# Altium schematic sheet 13.Motor DriverB.SchDoc
size 297 x 209 mm
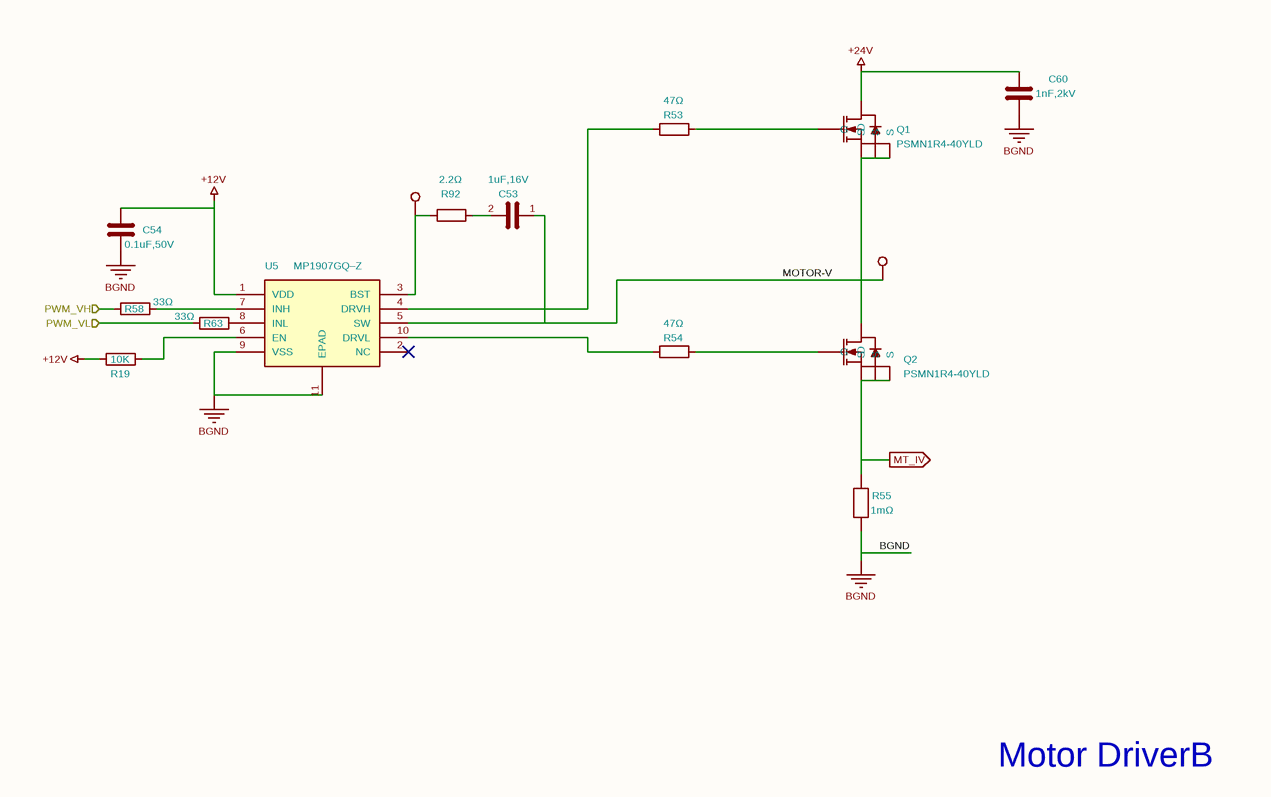
[diagram p0: 13.Motor DriverB.SchDoc]

## Parts
C53  1uF,16V  [C_0603_1608Metric]
C54  0.1uF,50V  [C_0603_1608Metric]
C60  1nF,2kV  [C_1206_3216Metric]
Q1  PSMN1R4-40YLD  [sot_669_2]
Q2  PSMN1R4-40YLD  [sot_669_2]
R19  10K  [R_0402_1005Metric]
R53  47Ω  [R_0603_1608Metric]
R54  47Ω  [R_0603_1608Metric]
R55  1mΩ  [R2010]
R58  33Ω  [R_0402_1005Metric]
R63  33Ω  [R_0402_1005Metric]
R92  2.2Ω  [R_0603_1608Metric]
TP4  0.5mm  [SMD_3mm_Pad]  (value not drawn)
TP16  0.5mm  [TestPoint_Pad_D0.5mm]  (value not drawn)
U5  MP1907GQ–Z  [QFN-10_L3.0-W3.0-P0.50-LS3.0-BL-EP]

## Ports
MT_IV (out), PWM_VH (in), PWM_VL (in)

## Nets
+12V: C54.1 R19.1 U5.1(VDD)
+24V: C60.1 Q1.5(D)
BGND: C54.2 C60.2 R55.1 U5.9(VSS) U5.11(EPAD)
MOTOR-V: C53.1 Q1.1(S) Q1.2(S) Q1.3(S) Q2.5(D) TP4.1 U5.5(SW)
MT_IV: Q2.1(S) Q2.2(S) Q2.3(S) R55.2 ; port MT_IV
PWM_VH: R58.1 ; port PWM_VH
PWM_VL: R63.1 ; port PWM_VL
NetC53_2: C53.2 R92.2
NetQ1_4: Q1.4(G) R53.2
NetQ2_4: Q2.4(G) R54.2
NetR19_2: R19.2 U5.6(EN)
NetR53_1: R53.1 U5.4(DRVH)
NetR54_1: R54.1 U5.10(DRVL)
NetR58_2: R58.2 U5.7(INH)
NetR63_2: R63.2 U5.8(INL)
NetR92_1: R92.1 TP16.1 U5.3(BST)

Not connected (* = marked no-connect by the designer): U5 2(NC)*

## Notes on the sheet
- Motor DriverB
- 1
- 2
- 3
- 4
- 5
- 6
- A
- B
- C
- D
- Title: HPM6E8Y_RbMotor_ECAT
- File: 13.Motor DriverB.kicad_sch
- Sheet: /
- KiCad E.D.A.  kicad (5.1.4)-1
- Size: A4
- Date:
- Rev: RevB+
- Id: 1/1

## Library data of the parts
C53 = 1uF,16V_0603: Model: CL10A105KO8NNNC; Company: SAMSUNG(三星); Value: 1uF,16V; Footprint: 03_HPM_Capacitance:C_0603_1608Metric
C54 = 0.1uF,50V,0603: Model: CC0603JRX7R9BB104; Company: YAGEO; Value: 0.1uF,50V; Footprint: 03_HPM_Capacitance:C_0603_1608Metric
C60 = 1nF,2kV_1206: Model: 1206B102K202NT; Company: FH(风华); Value: 1nF,2kV; Footprint: 03_HPM_Capacitance:C_1206_3216Metric
Q1 = PSMN1R4-40YLD_1: Company: Nexperia(安世); Model: PSMN1R4-40YLD; Value: PSMN1R4-40YLD; Footprint: 13_ower:sot_669_2
Q2 = PSMN1R4-40YLD: Company: Nexperia(安世); Model: PSMN1R4-40YLD; Value: PSMN1R4-40YLD; Footprint: 13_ower:sot_669_2
R19 = 10K_0402: Model: 0402WGF1002TCE; Company: UNI-ROYAL(厚声); Value: 10K; Footprint: 02_HPM_Resistor:R_0402_1005Metric
R53 R54 = 47Ω_0603: Model: 0603WAF470JT5E; Company: UNI-ROYAL(厚声); Value: 47Ω; Footprint: 02_HPM_Resistor:R_0603_1608Metric
R55 = 10mΩ_2512: Model: HoLR2010-1W-1mR-1%; Company: Milliohm(毫欧); Value: 1mΩ; Footprint: 13_ower:R2010
R58 R63 = 33Ω_0402: Model: 0402WGF330JTCE; Company: UNI-ROYAL(厚声); Value: 33Ω; Footprint: 02_HPM_Resistor:R_0402_1005Metric
R92 = 2.2Ω_0603: Model: 0603WAF220KT5E; Company: UNI-ROYAL(厚声); Value: 2.2Ω; Footprint: 02_HPM_Resistor:R_0603_1608Metric
TP4 TP16 = TestPoint-0.5mm: Value: 0.5mm
  TP4: Footprint: 01_HPM_Peripheral:SMD_3mm_Pad
  TP16: Footprint: 01_HPM_Peripheral:TestPoint_Pad_D0.5mm
U5 = MP1907GQ–Z: Value: MP1907GQ–Z; Footprint: 06_HPM_LQFP:QFN-10_L3.0-W3.0-P0.50-LS3.0-BL-EP